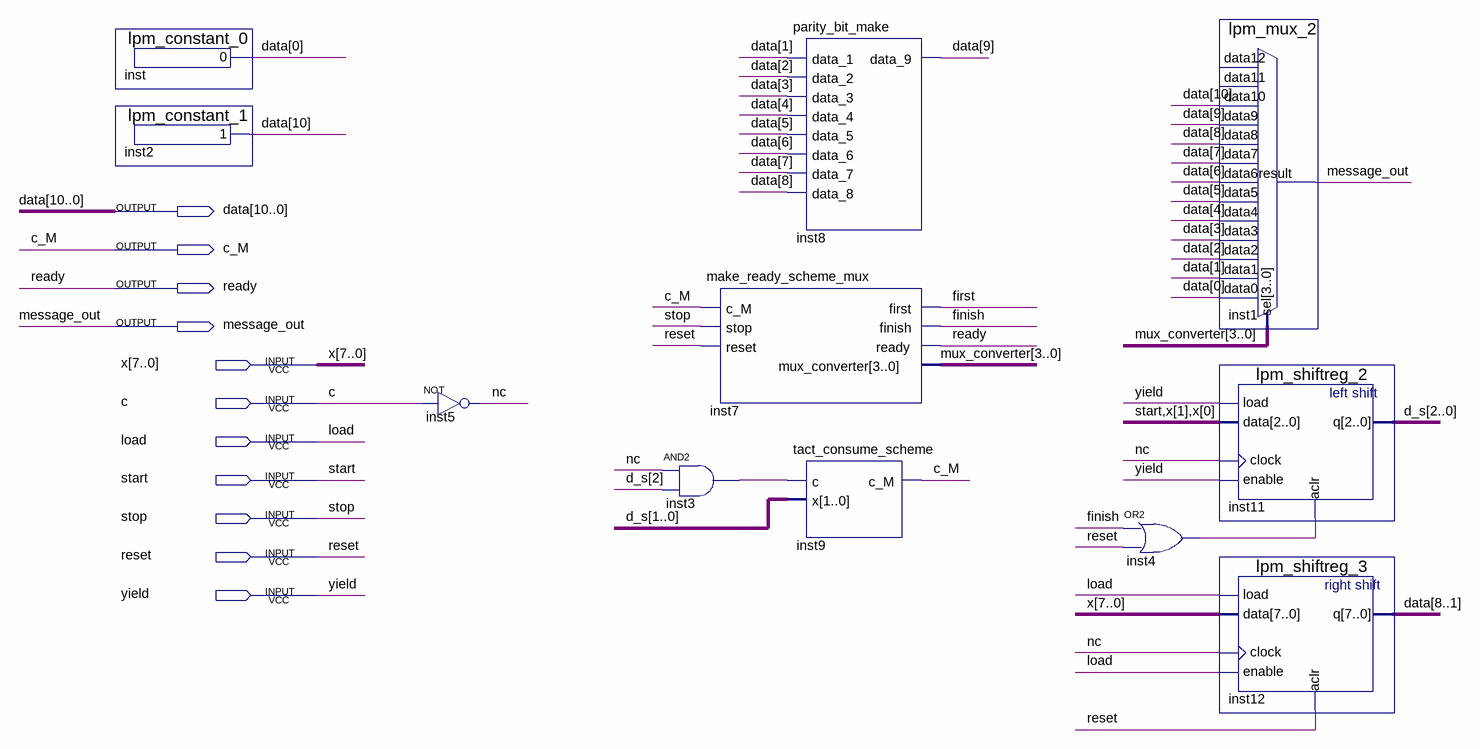
[diagram p0: schematic sheet]
// Quartus schematic parallel_into_serial_converter_mux.bdf as structural Verilog: 11 symbols, 11 pins
module parallel_into_serial_converter_mux (
  input  [7:0] x,
  input  c,
  input  load,
  input  start,
  input  stop,
  input  reset,
  input  yield,
  output [10:0] data,
  output c_M,
  output ready,
  output message_out
);

  wire finish, first, inst3_out, inst4_out, nc;
  wire [2:0] d_s;
  wire [3:0] mux_converter;

  lpm_constant_0 inst (.result(data[0]));
  lpm_constant_1 inst2 (.result(data[10]));
  not inst5 (nc, c);
  make_ready_scheme_mux inst7 (
    .c_M(c_M), .stop(stop), .reset(reset), .first(first), .finish(finish), .ready(ready),
    .mux_converter(mux_converter));
  and inst3 (inst3_out, nc, d_s[2]);
  parity_bit_make inst8 (
    .data_1(data[1]), .data_2(data[2]), .data_3(data[3]), .data_4(data[4]), .data_5(data[5]),
    .data_6(data[6]), .data_7(data[7]), .data_8(data[8]), .data_9(data[9]));
  tact_consume_scheme inst9 (.c(inst3_out), .x(d_s[1:0]), .c_M(c_M));
  or inst4 (inst4_out, finish, reset);
  lpm_mux_2 inst1 (
    .data10(data[10]), .data9(data[9]), .data8(data[8]), .data7(data[7]), .data6(data[6]), .data5(data[5]),
    .data4(data[4]), .data3(data[3]), .data2(data[2]), .data1(data[1]), .data0(data[0]), .sel(mux_converter),
    .result(message_out));  // open: data12, data11
  lpm_shiftreg_2 inst11 (.load(yield), .data({start, x[1:0]}), .clock(nc), .enable(yield), .aclr(inst4_out), .q(d_s));
  lpm_shiftreg_3 inst12 (.load(load), .data(x), .clock(nc), .enable(load), .aclr(reset), .q(data[8:1]));
endmodule
